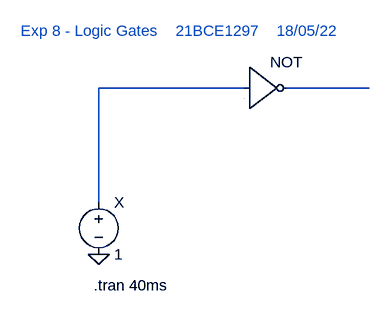
[diagram p0: schematic NOT.asc]
NOT.asc, the LTspice schematic file:
Version 4
SHEET 1 880 680
WIRE 320 32 96 32
WIRE 512 32 384 32
WIRE 96 208 96 32
FLAG 96 288 0
SYMBOL voltage 96 192 R0
SYMATTR InstName X
SYMATTR Value 1
SYMBOL Digital\\inv 320 -32 R0
SYMATTR InstName NOT
TEXT 88 336 Left 2 !.tran 40ms
TEXT -24 -56 Left 2 ;Exp 8 - Logic Gates    21BCE1297    18/05/22

The netlist it stands for:
* NOT.asc
V§X N001 0 1
A§NOT N001 0 0 0 0 N002 0 0 BUF
.tran 40ms
* Exp 8 - Logic Gates    21BCE1297    18/05/22
.backanno
.end